# EasyEDA Pro project ProPrj_6dof2_v3.epro

# Schematic Schematic1
Board Name: Board1; Create Date: 2026-02-28; Page Name: P1; Project Name: 11; Schematic Name: Schematic1; Update Date: 2026-02-28; Company: EasyEDA.com; Page Size: A4; Version: V1.0
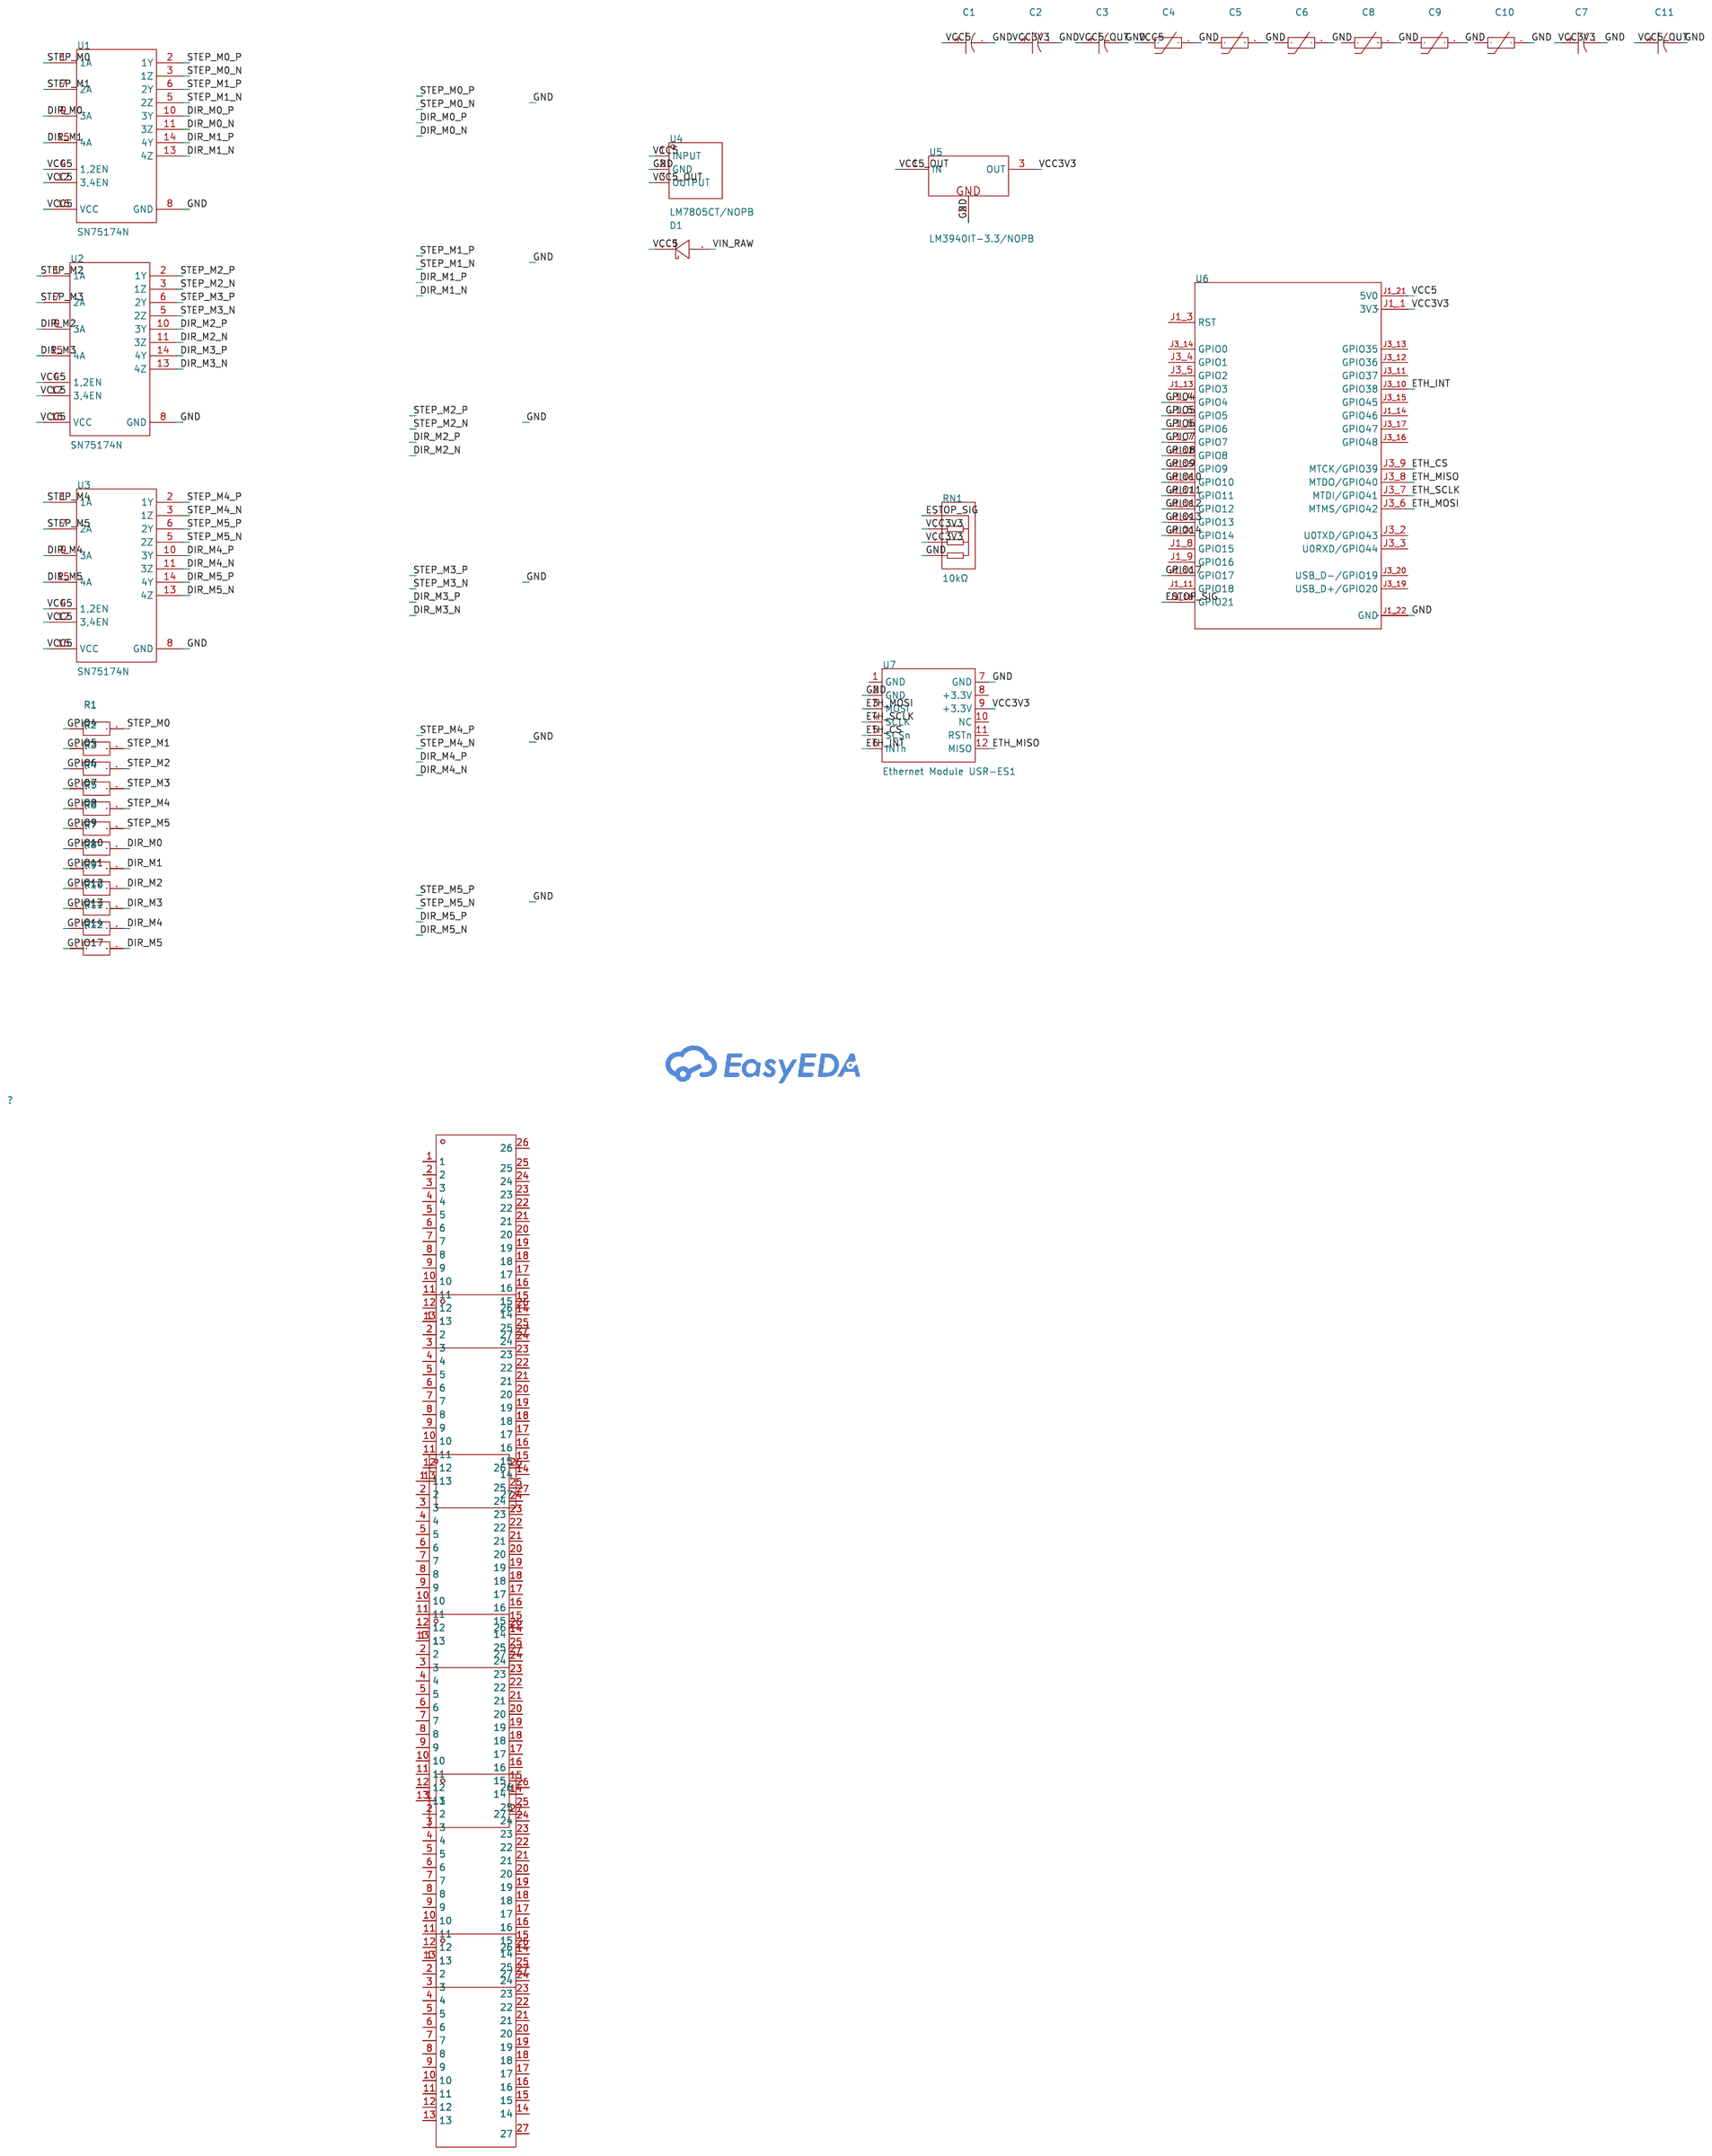
[diagram p0: schematic sheet]

## Parts
C1  100uF  [CAP-TH_BD6.3-P2.50-D1.0-FD]
C2  100uF  [CAP-TH_BD6.3-P2.50-D1.0-FD]
C3  100uF  [CAP-TH_BD6.3-P2.50-D1.0-FD]
C4  100nF  [CAP-TH_L8.0-W5.0-P10.00-D0.6]
C5  100nF  [CAP-TH_L8.0-W5.0-P10.00-D0.6]
C6  100nF  [CAP-TH_L8.0-W5.0-P10.00-D0.6]
C7  100uF  [CAP-TH_BD6.3-P2.50-D1.0-FD]
C8  100nF  [CAP-TH_L8.0-W5.0-P10.00-D0.6]
C9  100nF  [CAP-TH_L8.0-W5.0-P10.00-D0.6]
C10  100nF  [CAP-TH_L8.0-W5.0-P10.00-D0.6]
C11  100uF  [CAP-TH_BD6.3-P2.50-D1.0-FD]
D1  SB140  [DO-41_BD2.4-L4.7-P8.70-D0.6-RD]
DSUB?#1  -  [DSUB-TH_DS1037-25FNAKT74-0CC]
DSUB?#2  -  [DSUB-TH_DS1037-25FNAKT74-0CC]
DSUB?#3  -  [DSUB-TH_DS1037-25FNAKT74-0CC]
DSUB?#4  -  [DSUB-TH_DS1037-25FNAKT74-0CC]
DSUB?#5  -  [DSUB-TH_DS1037-25FNAKT74-0CC]
DSUB?#6  -  [DSUB-TH_DS1037-25FNAKT74-0CC]
R1  33Ω  [RES-TH_BD2.3-L6.5-P10.50-D0.5]
R2  33Ω  [RES-TH_BD2.3-L6.5-P10.50-D0.5]
R3  33Ω  [RES-TH_BD2.3-L6.5-P10.50-D0.5]
R4  33Ω  [RES-TH_BD2.3-L6.5-P10.50-D0.5]
R5  33Ω  [RES-TH_BD2.3-L6.5-P10.50-D0.5]
R6  33Ω  [RES-TH_BD2.3-L6.5-P10.50-D0.5]
R7  33Ω  [RES-TH_BD2.3-L6.5-P10.50-D0.5]
R8  33Ω  [RES-TH_BD2.3-L6.5-P10.50-D0.5]
R9  33Ω  [RES-TH_BD2.3-L6.5-P10.50-D0.5]
R10  33Ω  [RES-TH_BD2.3-L6.5-P10.50-D0.5]
R11  33Ω  [RES-TH_BD2.3-L6.5-P10.50-D0.5]
R12  33Ω  [RES-TH_BD2.3-L6.5-P10.50-D0.5]
RN1  10kΩ  [RES-ARRAY-TH_4P-P2.54-D1.0]
U1  SN75174N  [DIP-16_L20.0-W6.4-P2.54-LS7.6-BL]
U2  SN75174N  [DIP-16_L20.0-W6.4-P2.54-LS7.6-BL]
U3  SN75174N  [DIP-16_L20.0-W6.4-P2.54-LS7.6-BL]
U4  LM7805CT/NOPB  [TO-220-3_L10.0-W4.5-P2.54-T]
U5  LM3940IT-3.3/NOPB  [TO-220-3_L10.2-W4.6-P2.54-L]
U6  -  [XCVR_ESP32-S3-DEVKITC-1-N8R2]
U7  Ethernet Module USR-ES1  [COMM_ETHERNET-MODULE-USR-ES1]

## Library data of the parts
C1-C3 C7 C11 = GR107V025E11RR0VH4FP0: Capacitance:100uF Tolerance:-10%~+20% Tolerance:-10%~+20% Voltage Rating:25V Ripple Current:340mA@100kHz Equivalent Series Resistance(ESR):- Pin Spacing:2.5mm Diameter:6.3mm Height - Seated (Max):11mm Lifetime:2000hrs@105℃ Operating Temperature:-40℃~+105℃; LCSC Part Name: 100uF -10%~+20% 25V; Supplier Part: C44601; Manufacturer: Chengx(承兴); Supplier Footprint: 插件,D6.3xL11mm; JLCPCB Part Class: Extended Part; Datasheet: https://item.szlcsc.com/datasheet/GR107V025E11RR0VH4FP0/45603.html; Supplier: LCSC; Tolerance: -10%~+20%; Voltage Rating: 25V; Ripple Current: 340mA@100kHz; Pin Spacing: 2.5mm; Diameter: 6.3mm; Height - Seated (Max): 11mm; Lifetime: 2000hrs@105℃; Operating Temperature: -40℃~+105℃
C4-C6 C8-C10 = C315C104M5U5TA: Capacitance:100nF Tolerance:±20% Tolerance:±20% Voltage Rating:50V Temperature Coefficient:Z5U; LCSC Part Name: 100nF ±20% 50V; Supplier Part: C1620210; Manufacturer: KEMET(基美); Supplier Footprint: 插件; JLCPCB Part Class: Extended Part; Datasheet: https://item.szlcsc.com/datasheet/C315C104M5U5TA/1711055.html; Supplier: LCSC; Tolerance: ±20%; Voltage Rating: 50V; Temperature Coefficient: Z5U
D1 = SB140: Diode Configuration:1 Independent Voltage - Forward(Vf@If):500mV@1A Voltage - DC Reverse(Vr):40V Current - Rectified:1A Reverse Leakage Current (Ir):500uA@40V Operating Junction Temperature Range:-65℃~+125℃ Operating Junction Temperature Range:-65℃~+125℃; LCSC Part Name: 电压:40V 电流:1A; Supplier Part: C896044; Manufacturer: onsemi(安森美); Supplier Footprint: DO-41; JLCPCB Part Class: Extended Part; Datasheet: https://item.szlcsc.com/datasheet/SB140/961481.html; Supplier: LCSC; Diode Configuration: 1 Independent; Voltage - Forward(Vf@If): 500mV@1A; Voltage - DC Reverse(Vr): 40V; Current - Rectified: 1A; Reverse Leakage Current (Ir): 500uA@40V; Operating Junction Temperature Range: -65℃~+125℃; Non-Repetitive Peak Forward Surge Current: 30A
DSUB?#1-DSUB?#6 = DS1037-25FNAKT74-0CC: Connector Type:D-Sub Gender:Female Number of Pins:25 Number of Rows:2 Mounting Style:Shrouded Current Rating (Max):1.5A Operating Temperature Range:-40℃~+105℃ Operating Temperature Range:-40℃~+105℃; LCSC Part Name: D-Sub 母 P数:25 黑色,脚距2.77mm,镀锡,带六角螺丝; Supplier Part: C77838; Manufacturer: CONNFLY; Supplier Footprint: 插件; JLCPCB Part Class: Extended Part; Datasheet: https://atta.szlcsc.com/upload/public/pdf/source/20160702/1467448308759.pdf; Supplier: LCSC; Connector Type: D-Sub; Gender: Female; Number of Pins: 25; Number of Rows: 2; Mounting Style: Shrouded; Current Rating (Max): 1.5A; Operating Temperature Range: -40℃~+105℃
R1-R12 = CF1/4W-33Ω±5%T52: Type:Carbon Film Resistor Resistance:33Ω Tolerance:±5% Tolerance:±5% Voltage-Supply(Max):250V Power(Watts):250mW Temperature Coefficient:-1500ppm/℃~+300ppm/℃ Temperature Coefficient:-1500ppm/℃~+300ppm/℃ Operating Temperature:-55℃~+125℃ Operating Temperatu; LCSC Part Name: 碳膜电阻 33Ω ±5% 250mW; Supplier Part: C714273; Manufacturer: 华星机电; Supplier Footprint: 插件,D2.3xL6.5mm; JLCPCB Part Class: Extended Part; Datasheet: https://item.szlcsc.com/datasheet/CF1%252F4W-33%25CE%25A9%25C2%25B15%2525T52/754598.html; Supplier: LCSC; Type: Carbon Film Resistor; Tolerance: ±5%; Voltage-Supply(Max): 250V; Power(Watts): 250mW; Temperature Coefficient: -1500ppm/℃~+300ppm/℃; Operating Temperature: -55℃~+125℃
RN1 = 4604X-101-103LF: Number of Resistors: Resistance:10kΩ Tolerance:±2% Tolerance:±2% Power(Watts):200mW Temperature Coefficient:±100ppm/℃ Temperature Coefficient:±100ppm/℃ Number of Pins:; LCSC Part Name: 10kΩ ±2%; Supplier Part: C1358483; Manufacturer: BOURNS; Supplier Footprint: SIP-4-2.54mm; JLCPCB Part Class: Extended Part; Datasheet: https://item.szlcsc.com/datasheet/4604X-101-103LF/1448770.html; Supplier: LCSC; Tolerance: ±2%; Power(Watts): 200mW; Temperature Coefficient: ±100ppm/℃
U1-U3 = SN75174N: Types:Driver Number of Driver:4 Number of receiver:0 Supply Voltage:4.75V~5.25V Supply Voltage:4.75V~5.25V Operating Temperature:0℃~+70℃ Operating Temperature:0℃~+70℃; LCSC Part Name: 四通道差分线驱动器; Supplier Part: C77813; Manufacturer: TI(德州仪器); Supplier Footprint: DIP-16; JLCPCB Part Class: Extended Part; Datasheet: https://www.ti.com/cn/lit/gpn/sn75174; Supplier: LCSC; Types: Driver; Number of Driver: 4; Number of receiver: 0; Supply Voltage: 4.75V~5.25V; Operating Temperature: 0℃~+70℃
U4 = LM7805CT/NOPB: Output Type:Fixed Voltage - Supply:20V Output Voltage:5V Output Voltage:5V Output Current:1A Power Supply Rejection Ratio (PSRR):62dB@(120Hz) Voltage Dropout:2V@(1A) standby current:8mA Noise:40uV Features:Short Circuit Protection；Over Temperature Protect; LCSC Part Name: 1.5A、30V 线性稳压器; Supplier Part: C50931; Manufacturer: TI(德州仪器); Supplier Footprint: TO-220; JLCPCB Part Class: Extended Part; Datasheet: https://www.ti.com/cn/lit/gpn/lm7800; Supplier: LCSC; Output Type: Fixed; Voltage - Supply: 20V; Output Voltage: 5V; Output Current: 1A; Power Supply Rejection Ratio (PSRR): 62dB@(120Hz); Voltage Dropout: 2V@(1A); standby current: 8mA; Noise: 40uV; Features: Short Circuit Protection；Over Temperature Protection；Over Current Protection; Operating Temperature: 0℃~+70℃@(Ta); Output Configuration: Positive; Number of Outputs: 1
U5 = LM3940IT-3.3/NOPB: Output Type:Fixed Voltage - Supply:7.5V Output Voltage:3.3V Output Voltage:3.3V Output Current:1A Voltage Dropout:200mV@(100mA) Operating Temperature:-40℃~+125℃ Operating Temperature:-40℃~+125℃ Output Configuration:Positive electrode Number of Outputs:1; LCSC Part Name: 用于 5V 至 3.3V 电压转换的 1A 低压降稳压器; Supplier Part: C2863697; Manufacturer: TI(德州仪器); Supplier Footprint: TO-220; JLCPCB Part Class: Extended Part; Datasheet: https://www.ti.com/cn/lit/gpn/lm3940; Supplier: LCSC; Output Type: Fixed; Voltage - Supply: 7.5V; Output Voltage: 3.3V; Output Current: 1A; Voltage Dropout: 200mV@(100mA); Operating Temperature: -40℃~+125℃; Output Configuration: Positive electrode; Number of Outputs: 1
U6 = ESP32-S3-DEVKITC-1-N8R2
U7 = Ethernet Module USR-ES1: Supplier Part: C9900201496; Supplier Footprint: Through hole; JLCPCB Part Class: Extended Part; Supplier: LCSC

## Nets
GND: C1.2 C2.2 C3.2 C4.2 C5.2 C6.2 C7.2 C8.2 C9.2 C10.2 C11.2 RN1.4 U1.8(GND) U2.8(GND) U3.8(GND) U4.2(GND) U5.2(GND) U6.J1_22(GND) U6.J3_1(GND) U6.J3_21(GND) U6.J3_22(GND) U7.2(GND) U7.7(GND)
VCC3V3: C2.1 C7.1 RN1.2 RN1.3 U5.3(OUT) U6.J1_1(3V3) U6.J1_2(3V3) U7.9(+3.3V)
VCC5: C1.1 C4.1 D1.1(C) U1.4(1,2EN) U1.12(3,4EN) U1.16(VCC) U2.4(1,2EN) U2.12(3,4EN) U2.16(VCC) U3.4(1,2EN) U3.12(3,4EN) U3.16(VCC) U4.1(INPUT) U6.J1_21(5V0)
VCC5_OUT: C3.1 C11.1 U4.3(OUTPUT) U5.1(IN)
VIN_RAW: D1.2(A)
DIR_M0: R7.2 U1.9(3A)
DIR_M0_N: U1.11(3Z)
DIR_M0_P: U1.10(3Y)
DIR_M1: R8.2 U1.15(4A)
DIR_M1_N: U1.13(4Z)
DIR_M1_P: U1.14(4Y)
DIR_M2: R9.2 U2.9(3A)
DIR_M2_N: U2.11(3Z)
DIR_M2_P: U2.10(3Y)
DIR_M3: R10.2 U2.15(4A)
DIR_M3_N: U2.13(4Z)
DIR_M3_P: U2.14(4Y)
DIR_M4: R11.2 U3.9(3A)
DIR_M4_N: U3.11(3Z)
DIR_M4_P: U3.10(3Y)
DIR_M5: R12.2 U3.15(4A)
DIR_M5_N: U3.13(4Z)
DIR_M5_P: U3.14(4Y)
ESTOP_SIG: RN1.1 U6.J3_18(GPIO21)
ETH_CS: U6.J3_9(MTCK/GPIO39) U7.5(SCSn)
ETH_INT: U6.J3_10(GPIO38) U7.6(INTn)
ETH_MISO: U6.J3_8(MTDO/GPIO40) U7.12(MISO)
ETH_MOSI: U6.J3_6(MTMS/GPIO42) U7.3(MOSI)
ETH_SCLK: U6.J3_7(MTDI/GPIO41) U7.4(SCLK)
GPIO4: R1.1 U6.J1_4(GPIO4)
GPIO5: R2.1 U6.J1_5(GPIO5)
GPIO6: R3.1 U6.J1_6(GPIO6)
GPIO7: R4.1 U6.J1_7(GPIO7)
GPIO8: R5.1 U6.J1_12(GPIO8)
GPIO9: R6.1 U6.J1_15(GPIO9)
GPIO10: R7.1 U6.J1_16(GPIO10)
GPIO11: R8.1 U6.J1_17(GPIO11)
GPIO12: R9.1 U6.J1_18(GPIO12)
GPIO13: R10.1 U6.J1_19(GPIO13)
GPIO14: R11.1 U6.J1_20(GPIO14)
GPIO17: R12.1 U6.J1_10(GPIO17)
STEP_M0: R1.2 U1.1(1A)
STEP_M0_N: U1.3(1Z)
STEP_M0_P: U1.2(1Y)
STEP_M1: R2.2 U1.7(2A)
STEP_M1_N: U1.5(2Z)
STEP_M1_P: U1.6(2Y)
STEP_M2: R3.2 U2.1(1A)
STEP_M2_N: U2.3(1Z)
STEP_M2_P: U2.2(1Y)
STEP_M3: R4.2 U2.7(2A)
STEP_M3_N: U2.5(2Z)
STEP_M3_P: U2.6(2Y)
STEP_M4: R5.2 U3.1(1A)
STEP_M4_N: U3.3(1Z)
STEP_M4_P: U3.2(1Y)
STEP_M5: R6.2 U3.7(2A)
STEP_M5_N: U3.5(2Z)
STEP_M5_P: U3.6(2Y)
Net-(DSUB?#1-1): DSUB?#1.1 DSUB?#2.13
Net-(DSUB?#3-1): DSUB?#3.1 DSUB?#4.13
Net-(DSUB?#5-1): DSUB?#5.1 DSUB?#6.13

Not connected (* = marked no-connect by the designer): C5 1; C6 1; C8 1; C9 1; C10 1; DSUB?#1 2 3 4 5 6 7 8 9 10 11 12 13 14 15 16 17 18 19 20 21 22 23 24 25 26 27; DSUB?#2 1 2 3 4 5 6 7 8 9 10 11 12 14 15 16 17 18 19 20 21 22 23 24 25 26 27; DSUB?#3 2 3 4 5 6 7 8 9 10 11 12 13 14 15 16 17 18 19 20 21 22 23 24 25 26 27; DSUB?#4 1 2 3 4 5 6 7 8 9 10 11 12 14 15 16 17 18 19 20 21 22 23 24 25 26 27; DSUB?#5 2 3 4 5 6 7 8 9 10 11 12 13 14 15 16 17 18 19 20 21 22 23 24 25 26 27; DSUB?#6 1 2 3 4 5 6 7 8 9 10 11 12 14 15 16 17 18 19 20 21 22 23 24 25 26 27; U6 J1_3(RST) J1_8(GPIO15) J1_9(GPIO16) J1_11(GPIO18) J1_13(GPIO3) J1_14(GPIO46) J3_2(U0TXD/GPIO43) J3_3(U0RXD/GPIO44) J3_4(GPIO1) J3_5(GPIO2) J3_11(GPIO37) J3_12(GPIO36) J3_13(GPIO35) J3_14(GPIO0) J3_15(GPIO45) J3_16(GPIO48) J3_17(GPIO47) J3_19(USB_D+/GPIO20) J3_20(USB_D-/GPIO19); U7 1(GND) 8(+3.3V) 10(NC) 11(RSTn)
